# Altium schematic sheet 4 - Audio Amplifier.SchDoc
size Tabloid
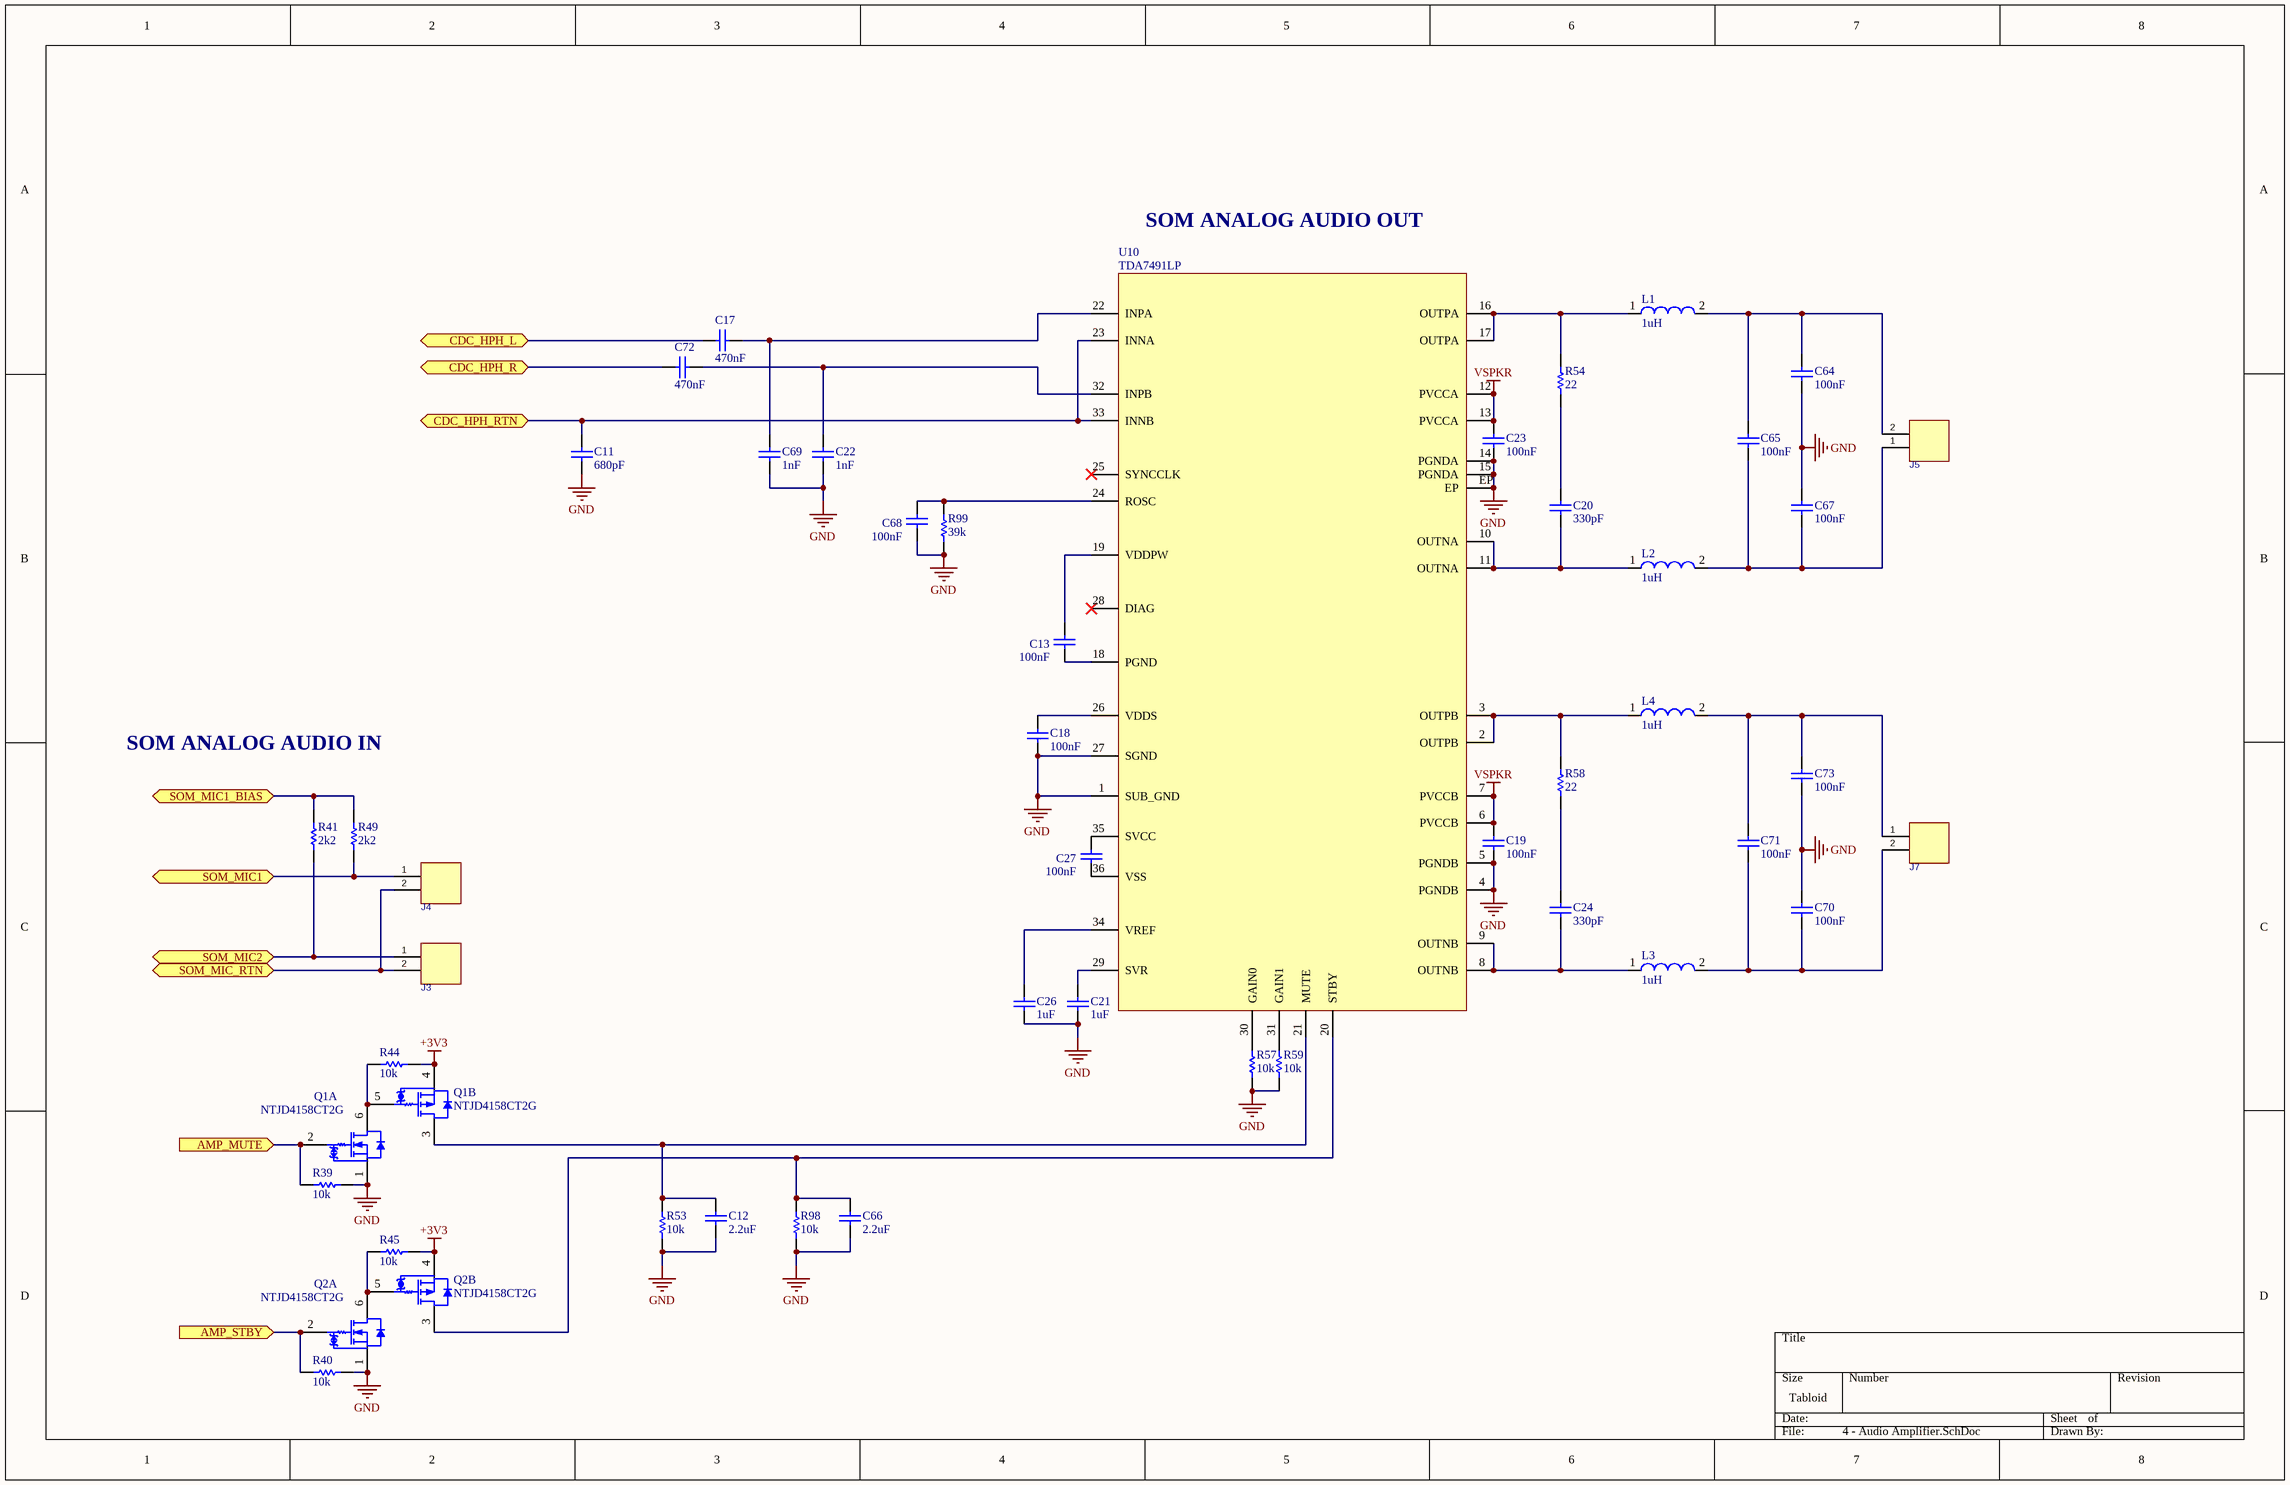
[diagram p0: 4 - Audio Amplifier.SchDoc]

## Parts
C11  value 680pF  [CAPC0805(2012)100_L]
C12  value 2.2uF  [CAPC0805(2012)145_L]  (hidden comment: CAP 22uF 16V 0805(2012))
C13  value 100nF  [CAPC0805(2012)100_L]  (hidden comment: CAP 100nF 25V 0805(2012))
C17  value 470nF  [CAPC0805(2012)100_L]
C18  value 100nF  [CAPC0805(2012)100_L]  (hidden comment: CAP 100nF 25V 0805(2012))
C19  value 100nF  [CAPC0805(2012)100_L]  (hidden comment: CAP 100nF 25V 0805(2012))
C20  value 330pF  [CAPC0805(2012)100_L]
C21  value 1uF  [CAPC0805(2012)145_L]  (hidden comment: CAP 22uF 16V 0805(2012))
C22  value 1nF  [CAPC0805(2012)100_L]
C23  value 100nF  [CAPC0805(2012)100_L]  (hidden comment: CAP 100nF 25V 0805(2012))
C24  value 330pF  [CAPC0805(2012)100_L]
C26  value 1uF  [CAPC0805(2012)145_L]  (hidden comment: CAP 22uF 16V 0805(2012))
C27  value 100nF  [CAPC0805(2012)100_L]  (hidden comment: CAP 100nF 25V 0805(2012))
C64  value 100nF  [CAPC0805(2012)100_L]  (hidden comment: CAP 100nF 25V 0805(2012))
C65  value 100nF  [CAPC0805(2012)100_L]  (hidden comment: CAP 100nF 25V 0805(2012))
C66  value 2.2uF  [CAPC0805(2012)145_L]  (hidden comment: CAP 22uF 16V 0805(2012))
C67  value 100nF  [CAPC0805(2012)100_L]  (hidden comment: CAP 100nF 25V 0805(2012))
C68  value 100nF  [CAPC0805(2012)100_L]  (hidden comment: CAP 100nF 25V 0805(2012))
C69  value 1nF  [CAPC0805(2012)100_L]
C70  value 100nF  [CAPC0805(2012)100_L]  (hidden comment: CAP 100nF 25V 0805(2012))
C71  value 100nF  [CAPC0805(2012)100_L]  (hidden comment: CAP 100nF 25V 0805(2012))
C72  value 470nF  [CAPC0805(2012)100_L]
C73  value 100nF  [CAPC0805(2012)100_L]  (hidden comment: CAP 100nF 25V 0805(2012))
J3  DF13-2P-1.25DS(20)  [HRS_DF13-2P-1.25DS(20)]  (value not drawn)
J4  DF13-2P-1.25DS(20)  [HRS_DF13-2P-1.25DS(20)]  (value not drawn)
J5  DF13-2P-1.25DS(20)  [HRS_DF13-2P-1.25DS(20)]  (value not drawn)
J7  DF13-2P-1.25DS(20)  [HRS_DF13-2P-1.25DS(20)]  (value not drawn)
L1  1uH  [SMD 0805_A]
L2  1uH  [SMD 0805_A]
L3  1uH  [SMD 0805_A]
L4  1uH  [SMD 0805_A]
Q1  NTJD4158CT2G  [ONSC-SC70-6-419B-02_W_V]  (parts A,B of 2)
Q2  NTJD4158CT2G  [ONSC-SC70-6-419B-02_W_V]  (parts A,B of 2)
R39  value 10k  [RESC0805(2012)_L]  (hidden comment: 10K 1% 0805(2012))
R40  value 10k  [RESC0805(2012)_L]  (hidden comment: 10K 1% 0805(2012))
R41  value 2k2  [RESC0805(2012)_L]
R44  value 10k  [RESC0805(2012)_L]  (hidden comment: 10K 1% 0805(2012))
R45  value 10k  [RESC0805(2012)_L]  (hidden comment: 10K 1% 0805(2012))
R49  value 2k2  [RESC0805(2012)_L]
R53  value 10k  [RESC0805(2012)_L]  (hidden comment: 10K 1% 0805(2012))
R54  value 22  [RESC0805(2012)_L]
R57  value 10k  [RESC0805(2012)_L]  (hidden comment: 10K 1% 0805(2012))
R58  value 22  [RESC0805(2012)_L]
R59  value 10k  [RESC0805(2012)_L]  (hidden comment: 10K 1% 0805(2012))
R98  value 10k  [RESC0805(2012)_L]  (hidden comment: 10K 1% 0805(2012))
R99  value 39k  [RESC0805(2012)_L]
U10  TDA7491LP  [POWERSSO-36]

## Ports
AMP_MUTE (in), AMP_STBY (in), CDC_HPH_L, CDC_HPH_R, CDC_HPH_RTN, SOM_MIC1, SOM_MIC1_BIAS, SOM_MIC2, SOM_MIC_RTN

## Nets
+3V3: Q1.4(S2) Q2.4(S2) R44.2 R45.2
GND: C11.1 C12.1 C18.2 C19.1 C21.1 C22.1 C23.1 C26.1 C64.1 C66.1 C67.2 C68.1 C69.1 C70.2 C73.1 Q1.1(S1) Q2.1(S1) R39.2 R40.2 R53.1 R57.2 R59.2 R98.1 R99.1 U10.1(SUB_GND) U10.4(PGNDB) U10.5(PGNDB) U10.14(PGNDA) U10.15(PGNDA) U10.27(SGND) U10.EP
VSPKR: C19.2 C23.2 U10.6(PVCCB) U10.7(PVCCB) U10.12(PVCCA) U10.13(PVCCA)
AMP_MUTE: Q1.2(G1) R39.1 ; port AMP_MUTE
AMP_STBY: Q2.2(G1) R40.1 ; port AMP_STBY
CDC_HPH_L: C17.2 ; port CDC_HPH_L
CDC_HPH_R: C72.2 ; port CDC_HPH_R
CDC_HPH_RTN: C11.2 U10.23(INNA) U10.33(INNB) ; port CDC_HPH_RTN
SOM_MIC1: J4.1 R49.2 ; port SOM_MIC1
SOM_MIC1_BIAS: R41.1 R49.1 ; port SOM_MIC1_BIAS
SOM_MIC2: J3.1 R41.2 ; port SOM_MIC2
SOM_MIC_RTN: J3.2 J4.2 ; port SOM_MIC_RTN
NetC12_2: C12.2 Q1.3(D2) R53.2 U10.21(MUTE)
NetC13_1: C13.1 U10.18(PGND)
NetC13_2: C13.2 U10.19(VDDPW)
NetC17_1: C17.1 C69.2 U10.22(INPA)
NetC18_1: C18.1 U10.26(VDDS)
NetC20_1: C20.1 L2.1 U10.10(OUTNA) U10.11(OUTNA)
NetC20_2: C20.2 R54.1
NetC21_2: C21.2 U10.29(SVR)
NetC22_2: C22.2 C72.1 U10.32(INPB)
NetC24_1: C24.1 L3.1 U10.8(OUTNB) U10.9(OUTNB)
NetC24_2: C24.2 R58.1
NetC26_2: C26.2 U10.34(VREF)
NetC27_1: C27.1 U10.36(VSS)
NetC27_2: C27.2 U10.35(SVCC)
NetC64_2: C64.2 C65.2 J5.2 L1.2
NetC65_1: C65.1 C67.1 J5.1 L2.2
NetC66_2: C66.2 Q2.3(D2) R98.2 U10.20(STBY)
NetC68_2: C68.2 R99.2 U10.24(ROSC)
NetC70_1: C70.1 C71.1 J7.2 L3.2
NetC71_2: C71.2 C73.2 J7.1 L4.2
NetL1_1: L1.1 R54.2 U10.16(OUTPA) U10.17(OUTPA)
NetL4_1: L4.1 R58.2 U10.2(OUTPB) U10.3(OUTPB)
NetQ1_5: Q1.5(G2) Q1.6(D1) R44.1
NetQ2_5: Q2.5(G2) Q2.6(D1) R45.1
NetR57_1: R57.1 U10.30(GAIN0)
NetR59_1: R59.1 U10.31(GAIN1)

Not connected (* = marked no-connect by the designer): U10 25(SYNCCLK)* 28(DIAG)*

## Notes on the sheet
- SOM ANALOG AUDIO OUT
- SOM ANALOG AUDIO IN

## Library data of the parts
C11 = CMP-1036-04520-1: CAP 220nF 6.3V Â±20% 0805 (2012 Metric) Thickness 1mm SMD; Case-Metric: 2012; Case-EIA: 0805; Technology: SMT; Tolerance: Â±20%; Max Thickness: 1 mm; Rated Voltage: 6.3 V
C12 C21 C26 C66 = CMP-1036-04946-1: CAP 22uF 16V Â±20% 0805 (2012 Metric) Thickness 1.45mm SMD; Case-Metric: 2012; Case-EIA: 0805; Tolerance: Â±20%; Max Thickness: 1.45 mm; Rated Voltage: 16 V; Technology: SMT
C13 C18-C20 C23 C24 C27 C64 C65 C67 C68 C70 C71 C73 = CMP-1036-04411-1: CAP 100nF 25V Â±10% 0805 (2012 Metric) Thickness 1mm SMD; Case-EIA: 0805; Case-Metric: 2012; Max Thickness: 1 mm; Rated Voltage: 25 V; Technology: SMT; Tolerance: Â±10%
C17 C22 C69 C72 = CMP-1036-04411-1: Case-EIA: 0805; Rated Voltage: 25 V; Case-Metric: 2012; Tolerance: Â±10%; Max Thickness: 1 mm; Technology: SMT
J3-J5 J7 = CON_HRS_DF13-2P-1.25DS(20): CONN HEADER 2POS 1.25MM R/A THT TIN; Manufacturer: Hirose Electric Co Ltd; Connector Type: Header, Shrouded; Number of Positions: 2; Number of Positions Loaded: All; Pitch: 0.049" (1.25mm); Manufacturer Part Number: DF13-2P-1.25DS(20); RoHS: RoHS Compliant; Category: Connectors, Interconnects; Packaging: Tube; Contact Type: Male Pin; Number of Rows: 1; Row Spacing: -; Contact Mating Length: -; Mounting Type: Through Hole, Right Angle; Termination: Solder; Fastening Type: -; Features: Board Guide; Contact Finish: Tin; Contact Finish Thickness: -; Color: Beige; ComponentLink1URL: http://www.hirose.co.jp/cataloge_hp/2d/EDC3-081817-01.pdf; ComponentLink1Description: http://www.hirose.co.jp/cataloge_hp/2d/EDC3-081817-01.pdf
L1-L4 = CMP-1392-00033-1: Power Multilayer Inductor WE-PMI, L=1.00 ÂµH; PartNumber: 74479775210; Manufacturer: Wuerth Elektronik; ComponentLink1URL: http://www.we-online.com; PackageReference: SMD 0805_A; Inductance: 1.00 ÂµH; ComponentLink1Description: Manufacturer URL; ComponentLink2Description: Datasheet; ComponentLink2URL: http://katalog.we-online.de/kataloge/eisos/media/pdf/74479775210A.pdf
Q1 Q2 = CMP-1058-00639-1: Small Signal MOSFET, 30 V / -20 V, +0.25 / -0.88 A, Complementary, 6-Pin SC70, Pb-Free, Tape and Reel; Manufacturer: On Semiconductor; VGS(th) Max (V): 1.5; PD Max (W): 0.27; Configuration: Dual; ComponentLink1URL: http://www.onsemi.com/; DatasheetVersion: Rev. 2; RoHS: Pb-Free; Mounting Technology: Surface Mount; PartNumber: NTJD4158CT2G; ComponentLink3Description: Package Specification; ComponentLink2URL: http://www.onsemi.com/pub_link/Collateral/NTJD4158C-D.PDF; ComponentLink1Description: Manufacturer URL; Packing: Tape and Reel; ComponentLink2Description: Datasheet; PackageDescription: 6-Pin Small Outline Transistor, Body 2 x 1.25 mm, Pitch 0.65 mm; ComponentLink3URL: http://www.onsemi.com/pub_link/Collateral/SMF05C-D.PDF; Channel Polarity: Complementary; PackageReference: SC70-6-419B-02_W; Package Type: SC-88-6 / SC-70-6 / SOT-363-6; PackageVersion: Rev. W; PartId: 1
R39-R41 R44 R45 R49 R53 R57 R59 R98 = CMP-1013-00623-1: 10K 0.125W 1% 0805 (2012 Metric)  SMD; Case-Metric: 2012; Case-EIA: 0805; Tolerance: 1 %; Power: 0.125 W; Technology: SMT
R54 R58 = CMP-1013-00341-1: 33R 0.125W 1% 0805 (2012 Metric)  SMD; Case-EIA: 0805; Case-Metric: 2012; Technology: SMT; Power: 0.125 W; Tolerance: 1 %
R99 = CMP-1013-00341-1: Power: 0.125 W; Case-EIA: 0805; Tolerance: 1 %; Case-Metric: 2012; Technology: SMT
U10 = TDA7491LP: 2x5W DUAL BTL CLASS-D AUDIO AMPLIFIER